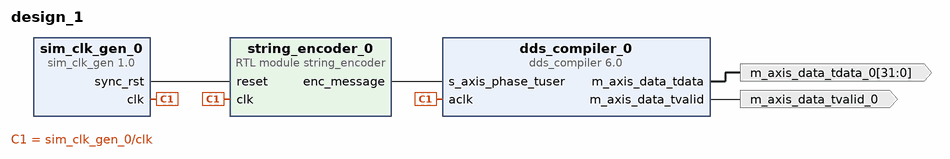
[diagram p0: block diagram of the top level]
# Vivado block design design_1, xck26-sfvc784-2LV-c, Vivado 2023.2
create_bd_design design_1

create_bd_port -dir O -from 31 -to 0 m_axis_data_tdata_0
create_bd_port -dir O m_axis_data_tvalid_0

create_bd_cell -type ip -vlnv xilinx.com:ip:dds_compiler:6.0 dds_compiler_0
set_property -dict [list \
  CONFIG.DATA_Has_TLAST Not_Required \
  CONFIG.Has_Phase_Out true \
  CONFIG.Has_TREADY false \
  CONFIG.Latency 6 \
  CONFIG.M_DATA_Has_TUSER User_Field \
  CONFIG.M_PHASE_Has_TUSER User_Field \
  CONFIG.Noise_Shaping None \
  CONFIG.OUTPUT_FORM Sign_and_Magnitude \
  CONFIG.Output_Frequency1 0 \
  CONFIG.Output_Width 16 \
  CONFIG.PINC1 0 \
  CONFIG.Parameter_Entry Hardware_Parameters \
  CONFIG.PartsPresent Phase_Generator_and_SIN_COS_LUT \
  CONFIG.Phase_Increment Streaming \
  CONFIG.Phase_Width 16 \
  CONFIG.Phase_offset Streaming \
  CONFIG.S_PHASE_Has_TUSER User_Field \
  CONFIG.S_PHASE_TUSER_Width 16 \
] [get_bd_cells dds_compiler_0]
create_bd_cell -type ip -vlnv xilinx.com:ip:sim_clk_gen:1.0 sim_clk_gen_0
create_bd_cell -type module -reference string_encoder string_encoder_0

# ---- connections ----

connect_bd_net [get_bd_pins dds_compiler_0/m_axis_data_tdata] [get_bd_ports m_axis_data_tdata_0]
connect_bd_net [get_bd_pins dds_compiler_0/m_axis_data_tvalid] [get_bd_ports m_axis_data_tvalid_0]
connect_bd_net [get_bd_pins sim_clk_gen_0/clk] [get_bd_pins string_encoder_0/clk] [get_bd_pins dds_compiler_0/aclk]
connect_bd_net [get_bd_pins sim_clk_gen_0/sync_rst] [get_bd_pins string_encoder_0/reset]
connect_bd_net [get_bd_pins string_encoder_0/enc_message] [get_bd_pins dds_compiler_0/s_axis_phase_tuser]

validate_bd_design
save_bd_design
